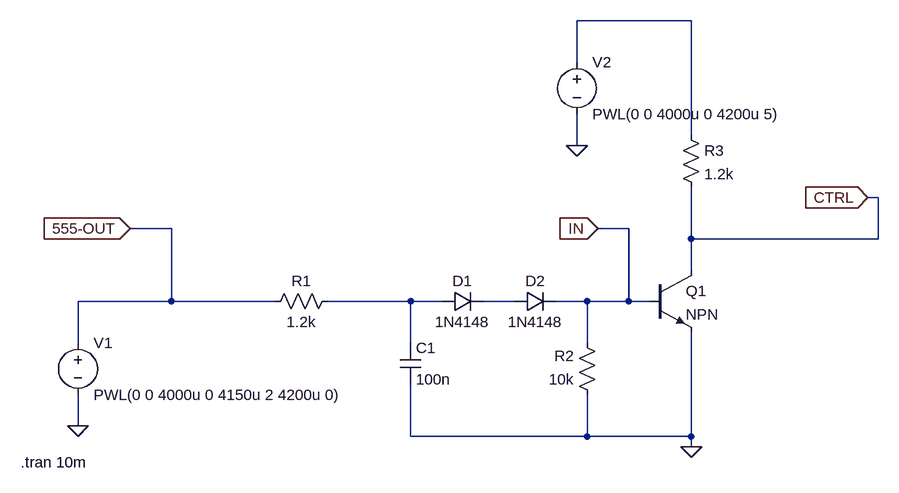
[diagram p0: schematic wdt_output.asc]
wdt_output.asc, the LTspice schematic file:
Version 4
SHEET 1 944 680
WIRE 576 -320 400 -320
WIRE 400 -256 400 -320
WIRE 576 -144 576 -320
WIRE 400 -128 400 -176
WIRE 864 -48 848 -48
WIRE -224 0 -288 0
WIRE 480 0 432 0
WIRE 576 16 576 -64
WIRE 864 16 864 -48
WIRE 864 16 576 16
WIRE 576 64 576 16
WIRE -224 112 -224 0
WIRE -224 112 -368 112
WIRE -64 112 -224 112
WIRE 144 112 16 112
WIRE 192 112 144 112
WIRE 304 112 256 112
WIRE 416 112 368 112
WIRE 480 112 480 0
WIRE 480 112 416 112
WIRE 512 112 480 112
WIRE -368 176 -368 112
WIRE 144 176 144 112
WIRE 416 176 416 112
WIRE -368 304 -368 256
WIRE 144 320 144 240
WIRE 416 320 416 256
WIRE 416 320 144 320
WIRE 576 320 576 160
WIRE 576 320 416 320
WIRE 576 336 576 320
FLAG 576 336 0
FLAG 400 -128 0
FLAG -368 304 0
FLAG 848 -48 CTRL
IOPIN 848 -48 In
FLAG -288 0 555-OUT
IOPIN -288 0 In
FLAG 432 0 IN
IOPIN 432 0 In
SYMBOL diode 192 128 R270
WINDOW 0 32 32 VTop 2
WINDOW 3 0 32 VBottom 2
SYMATTR InstName D1
SYMATTR Value 1N4148
SYMBOL diode 304 128 R270
WINDOW 0 32 32 VTop 2
WINDOW 3 0 32 VBottom 2
SYMATTR InstName D2
SYMATTR Value 1N4148
SYMBOL res 32 96 R90
WINDOW 0 0 56 VBottom 2
WINDOW 3 32 56 VTop 2
SYMATTR InstName R1
SYMATTR Value 1.2k
SYMBOL res 432 272 R180
WINDOW 0 36 76 Left 2
WINDOW 3 36 40 Left 2
SYMATTR InstName R2
SYMATTR Value 10k
SYMBOL npn 512 64 R0
SYMATTR InstName Q1
SYMBOL cap 128 176 R0
SYMATTR InstName C1
SYMATTR Value 100n
SYMBOL res 560 -160 R0
SYMATTR InstName R3
SYMATTR Value 1.2k
SYMBOL voltage -368 160 R0
WINDOW 123 0 0 Left 2
WINDOW 39 0 0 Left 2
SYMATTR InstName V1
SYMATTR Value PWL(0 0 4000u 0 4150u 2 4200u 0)
SYMBOL voltage 400 -272 R0
WINDOW 123 0 0 Left 2
WINDOW 39 0 0 Left 2
SYMATTR InstName V2
SYMATTR Value PWL(0 0 4000u 0 4200u 5)
TEXT -456 360 Left 2 !.tran 10m

The netlist it stands for:
* wdt_output.asc
D1 N002 N003 1N4148
D2 N003 IN 1N4148
R1 N002 555-OUT 1.2k
R2 0 IN 10k
Q1 CTRL IN 0 0 NPN
C1 N002 0 100n
R3 N001 CTRL 1.2k
V1 555-OUT 0 PWL(0 0 4000u 0 4150u 2 4200u 0)
V2 N001 0 PWL(0 0 4000u 0 4200u 5)
.model D D
.lib standard.dio
.model NPN NPN
.model PNP PNP
.lib standard.bjt
.tran 10m
.backanno
.end